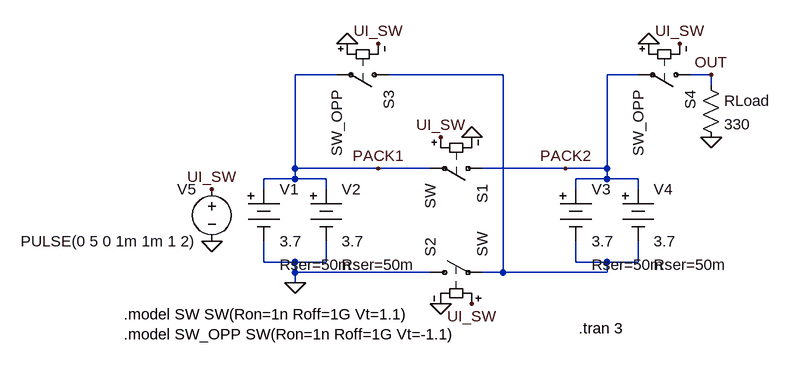
[diagram p0: schematic Battery_Pack_Rearrangement.asc]
Battery_Pack_Rearrangement.asc, the LTspice schematic file:
Version 4
SHEET 1 880 680
WIRE 160 -112 96 -112
WIRE 416 -112 240 -112
WIRE 624 -112 576 -112
WIRE 736 -112 704 -112
WIRE 736 -96 736 -112
WIRE 96 32 96 -112
WIRE 224 32 96 32
WIRE 304 32 224 32
WIRE 512 32 384 32
WIRE 576 32 576 -112
WIRE 576 32 512 32
WIRE 96 48 96 32
WIRE 96 48 48 48
WIRE 144 48 96 48
WIRE 576 48 576 32
WIRE 576 48 528 48
WIRE 624 48 576 48
WIRE 48 64 48 48
WIRE 144 64 144 48
WIRE 528 64 528 48
WIRE 624 64 624 48
WIRE 48 176 48 144
WIRE 96 176 48 176
WIRE 144 176 144 144
WIRE 144 176 96 176
WIRE 528 176 528 144
WIRE 576 176 528 176
WIRE 624 176 624 144
WIRE 624 176 576 176
WIRE 96 192 96 176
WIRE 304 192 96 192
WIRE 416 192 416 -112
WIRE 416 192 384 192
WIRE 576 192 576 176
WIRE 576 192 416 192
WIRE 96 208 96 192
FLAG 96 208 0
FLAG 320 240 0
FLAG 368 -16 0
FLAG 176 -160 0
FLAG 640 -160 0
FLAG 736 -16 0
FLAG -32 144 0
FLAG -32 64 UI_SW
FLAG 224 -160 UI_SW
FLAG 320 -16 UI_SW
FLAG 368 240 UI_SW
FLAG 688 -160 UI_SW
FLAG 512 32 PACK2
FLAG 224 32 PACK1
FLAG 736 -112 OUT
SYMBOL Misc\\battery 48 48 R0
WINDOW 123 0 0 Left 2
WINDOW 39 24 132 Left 2
SYMATTR InstName V1
SYMATTR Value 3.7
SYMATTR SpiceLine Rser=50m
SYMBOL Misc\\battery 144 48 R0
WINDOW 123 0 0 Left 2
WINDOW 39 24 132 Left 2
SYMATTR InstName V2
SYMATTR Value 3.7
SYMATTR SpiceLine Rser=50m
SYMBOL Misc\\battery 528 48 R0
WINDOW 123 0 0 Left 2
WINDOW 39 24 132 Left 2
SYMATTR InstName V3
SYMATTR Value 3.7
SYMATTR SpiceLine Rser=50m
SYMBOL Misc\\battery 624 48 R0
WINDOW 123 0 0 Left 2
WINDOW 39 24 132 Left 2
SYMATTR InstName V4
SYMATTR Value 3.7
SYMATTR SpiceLine Rser=50m
SYMBOL sw 400 32 R90
SYMATTR InstName S1
SYMBOL sw 288 192 R270
SYMATTR InstName S2
SYMBOL sw 256 -112 R90
SYMATTR InstName S3
SYMATTR Value SW_OPP
SYMBOL sw 720 -112 R90
SYMATTR InstName S4
SYMATTR Value SW_OPP
SYMBOL res 720 -112 R0
SYMATTR InstName RLoad
SYMATTR Value 330
SYMBOL voltage -32 48 M0
WINDOW 123 0 0 Left 2
WINDOW 39 0 0 Left 2
SYMATTR InstName V5
SYMATTR Value PULSE(0 5 0 1m 1m 1 2)
TEXT -168 256 Left 2 !.model SW SW(Ron=1n Roff=1G Vt=1.1)\n.model SW_OPP SW(Ron=1n Roff=1G Vt=-1.1)
TEXT 532 278 Left 2 !.tran 3

The netlist it stands for:
* Battery_Pack_Rearrangement.asc
V1 PACK1 0 3.7 Rser=50m
V2 PACK1 0 3.7 Rser=50m
V3 PACK2 N001 3.7 Rser=50m
V4 PACK2 N001 3.7 Rser=50m
S1 PACK2 PACK1 UI_SW 0 SW
S2 0 N001 UI_SW 0 SW
S3 N001 PACK1 0 UI_SW SW_OPP
S4 OUT PACK2 0 UI_SW SW_OPP
RLoad OUT 0 330
V5 UI_SW 0 PULSE(0 5 0 1m 1m 1 2)
.model SW SW(Ron=1n Roff=1G Vt=1.1)
.model SW_OPP SW(Ron=1n Roff=1G Vt=-1.1)
.tran 3
.backanno
.end

* Results of the author's LTspice run, read from the files saved beside the schematic
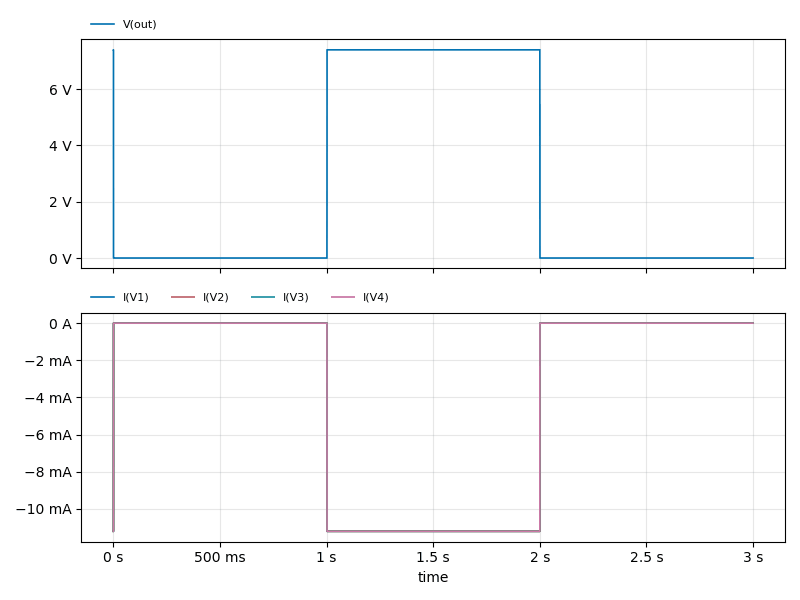
[diagram p1: Transient Analysis of Battery_Pack_Rearrangement.asc, plotted from the saved traces]
* Transient Analysis, 1 run:
*   V(out): min 1.222 µV, max 7.399 V, average 2.463 V, rms 4.269 V, last 1.222 µV
*   I(V1): min -11.21 mA, max -46.51 nA, average -3.732 mA, rms 6.468 mA, last -46.51 nA
*   I(V2): min -11.21 mA, max -46.51 nA, average -3.732 mA, rms 6.468 mA, last -46.51 nA
*   I(V3): min -11.21 mA, max -46.51 nA, average -3.732 mA, rms 6.468 mA, last -46.51 nA
*   I(V4): min -11.21 mA, max -46.51 nA, average -3.732 mA, rms 6.468 mA, last -46.51 nA